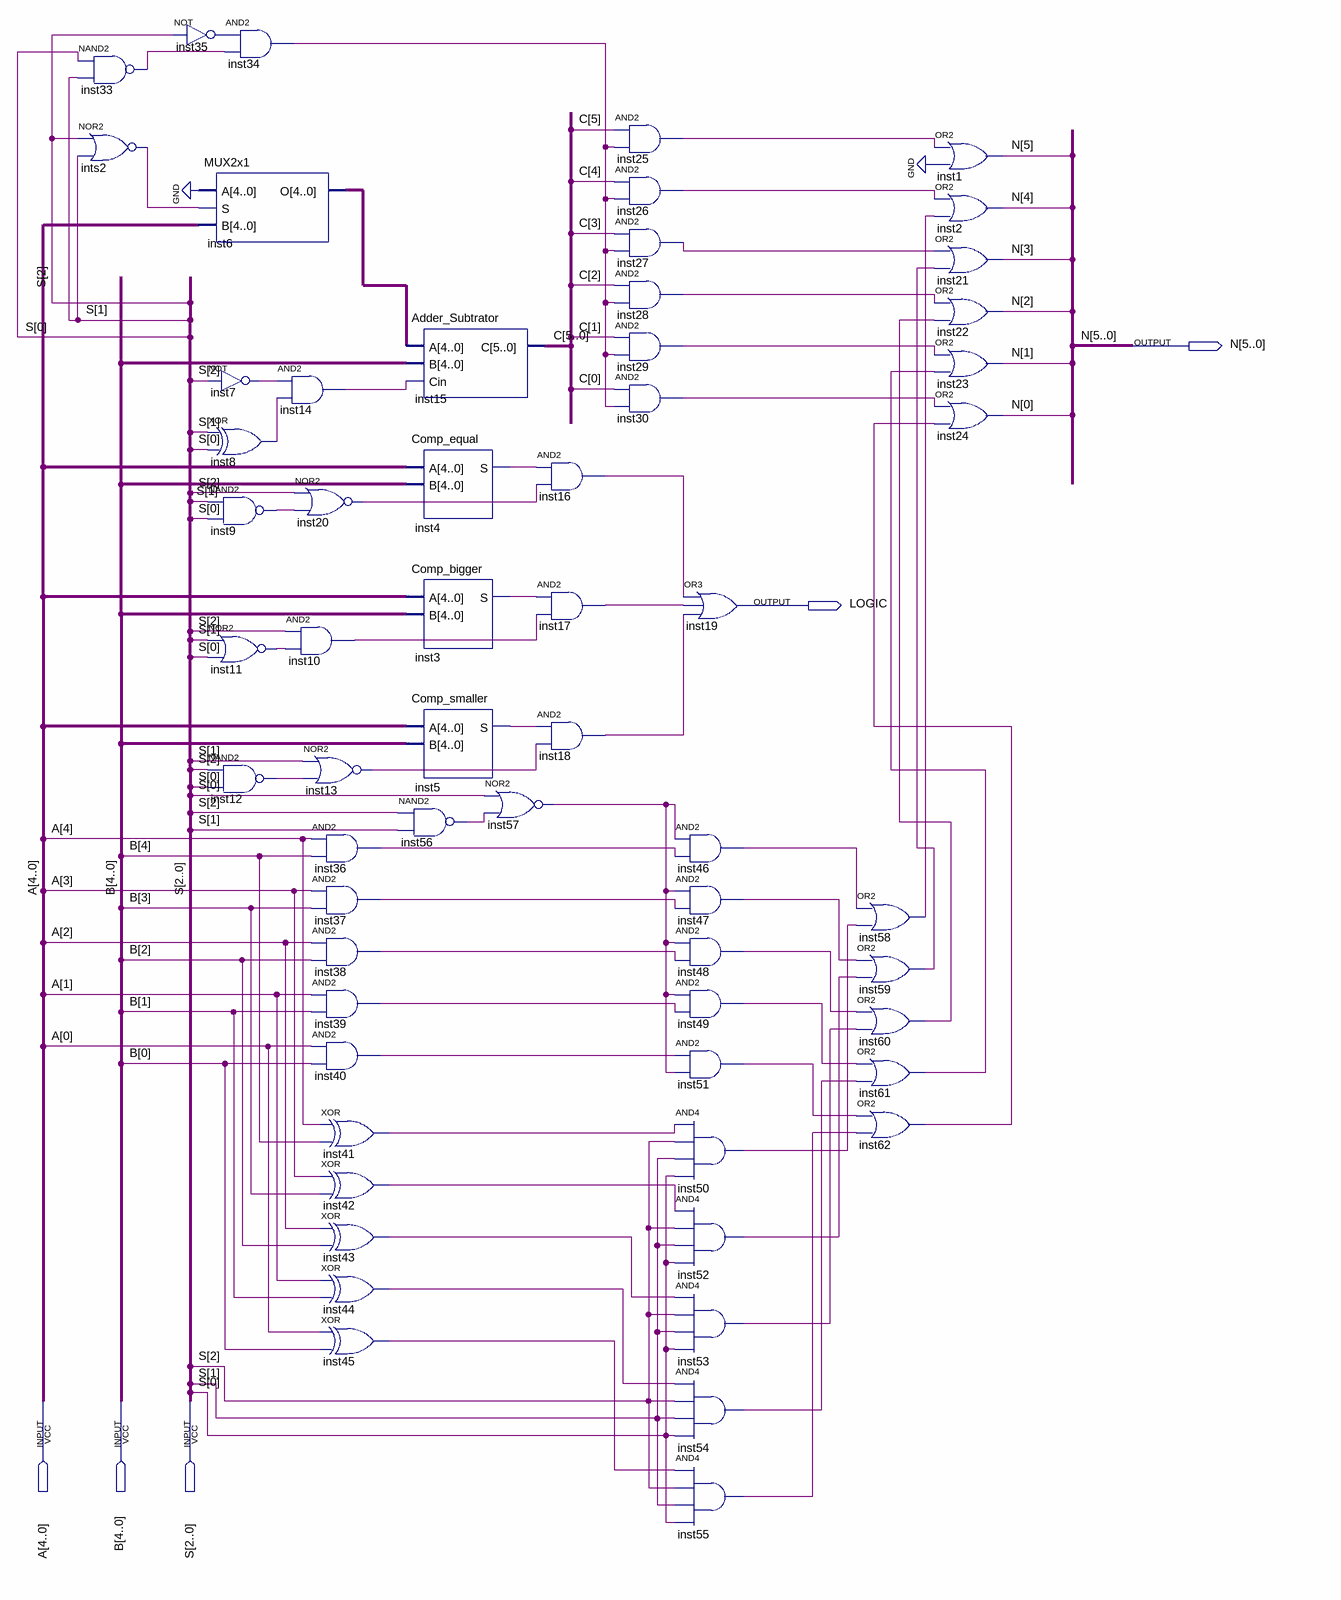
[diagram p0: schematic sheet]
// Quartus schematic Main.bdf as structural Verilog: 61 symbols, 5 pins
module Main (
  input  [4:0] A,
  input  [4:0] B,
  input  [2:0] S,
  output [5:0] N,
  output LOGIC
);

  wire inst3_s, inst4_s, inst5_s, inst7_out, inst8_out, inst9_out, inst10_out, inst11_out, inst12_out,
       inst13_out, inst14_out, inst16_out, inst17_out, inst18_out, inst20_out, inst25_out, inst26_out,
       inst27_out, inst28_out, inst29_out, inst30_out, inst33_out, inst34_out, inst35_out, inst36_out,
       inst37_out, inst38_out, inst39_out, inst40_out, inst41_out, inst42_out, inst43_out, inst44_out,
       inst45_out, inst46_out, inst47_out, inst48_out, inst49_out, inst50_out, inst51_out, inst52_out,
       inst53_out, inst54_out, inst55_out, inst56_out, inst57_out, inst58_out, inst59_out, inst60_out,
       inst61_out, inst62_out, ints2_out;
  wire [4:0] inst6_o;
  wire [5:0] C;

  nand inst33 (inst33_out, S[0], S[1]);
  nor ints2 (ints2_out, S[2], S[1]);
  not inst35 (inst35_out, S[2]);
  and inst34 (inst34_out, inst35_out, inst33_out);
  MUX2x1 inst6 (.A({5{1'b0}}), .S(ints2_out), .B(A), .O(inst6_o));
  not inst7 (inst7_out, S[2]);
  xor inst8 (inst8_out, S[1], S[0]);
  nand inst9 (inst9_out, S[1], S[0]);
  nor inst11 (inst11_out, S[1], S[0]);
  nand inst12 (inst12_out, S[2], S[0]);
  and inst14 (inst14_out, inst7_out, inst8_out);
  nor inst20 (inst20_out, S[2], inst9_out);
  and inst10 (inst10_out, S[2], inst11_out);
  nor inst13 (inst13_out, S[1], inst12_out);
  and inst36 (inst36_out, A[4], B[4]);
  and inst37 (inst37_out, A[3], B[3]);
  and inst38 (inst38_out, A[2], B[2]);
  and inst39 (inst39_out, A[1], B[1]);
  and inst40 (inst40_out, A[0], B[0]);
  xor inst41 (inst41_out, A[4], B[4]);
  xor inst42 (inst42_out, A[3], B[3]);
  xor inst43 (inst43_out, A[2], B[2]);
  xor inst44 (inst44_out, A[1], B[1]);
  xor inst45 (inst45_out, A[0], B[0]);
  nand inst56 (inst56_out, S[2], S[1]);
  Adder_Subtrator inst15 (.A(inst6_o), .B(B), .Cin(inst14_out), .C(C));
  Comp_equal inst4 (.A(A), .B(B), .S(inst4_s));
  Comp_bigger inst3 (.A(A), .B(B), .S(inst3_s));
  Comp_smaller inst5 (.A(A), .B(B), .S(inst5_s));
  and inst16 (inst16_out, inst4_s, inst20_out);
  and inst17 (inst17_out, inst3_s, inst10_out);
  and inst18 (inst18_out, inst5_s, inst13_out);
  nor inst57 (inst57_out, S[0], inst56_out);
  and inst25 (inst25_out, C[5], inst34_out);
  and inst26 (inst26_out, C[4], inst34_out);
  and inst27 (inst27_out, C[3], inst34_out);
  and inst28 (inst28_out, C[2], inst34_out);
  and inst29 (inst29_out, C[1], inst34_out);
  and inst30 (inst30_out, C[0], inst34_out);
  and inst46 (inst46_out, inst57_out, inst36_out);
  and inst47 (inst47_out, inst57_out, inst37_out);
  and inst48 (inst48_out, inst57_out, inst38_out);
  and inst49 (inst49_out, inst57_out, inst39_out);
  and inst51 (inst51_out, inst40_out, inst57_out);
  and inst50 (inst50_out, inst41_out, S[2], S[1], S[0]);
  and inst52 (inst52_out, inst42_out, S[2], S[1], S[0]);
  and inst53 (inst53_out, inst43_out, S[2], S[1], S[0]);
  and inst54 (inst54_out, inst44_out, S[2], S[1], S[0]);
  and inst55 (inst55_out, inst45_out, S[2], S[1], S[0]);
  or inst19 (LOGIC, inst16_out, inst17_out, inst18_out);
  or inst58 (inst58_out, inst46_out, inst50_out);
  or inst59 (inst59_out, inst47_out, inst52_out);
  or inst60 (inst60_out, inst48_out, inst53_out);
  or inst61 (inst61_out, inst49_out, inst54_out);
  or inst62 (inst62_out, inst51_out, inst55_out);
  or inst1 (N[5], inst25_out, 1'b0);
  or inst2 (N[4], inst26_out, inst58_out);
  or inst21 (N[3], inst27_out, inst59_out);
  or inst22 (N[2], inst28_out, inst60_out);
  or inst23 (N[1], inst29_out, inst61_out);
  or inst24 (N[0], inst30_out, inst62_out);
endmodule
